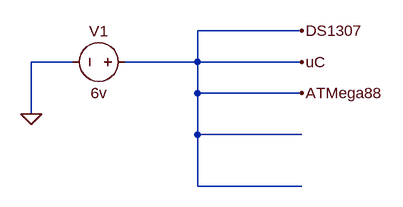
[diagram p0: schematic V_to_Load.asc]
V_to_Load.asc, the LTspice schematic file:
Version 4
SHEET 1 880 680
WIRE 256 112 96 112
WIRE -96 160 -160 160
WIRE 96 160 96 112
WIRE 96 160 -16 160
WIRE 256 160 96 160
WIRE 96 208 96 160
WIRE 256 208 96 208
WIRE -160 240 -160 160
WIRE 96 272 96 208
WIRE 256 272 96 272
WIRE 96 352 96 272
WIRE 256 352 96 352
FLAG 256 112 DS1307
FLAG 256 160 uC
FLAG 256 208 ATMega88
FLAG -160 240 0
SYMBOL voltage 0 160 R90
WINDOW 0 -32 56 VBottom 2
WINDOW 3 32 56 VTop 2
WINDOW 123 0 0 Left 0
WINDOW 39 0 0 Left 0
SYMATTR InstName V1
SYMATTR Value 6v

The netlist it stands for:
* V_to_Load.asc
V1 ATMega88 0 6v
.backanno
.end